# EAGLE design amyboard (EAGLE 9.6.2)
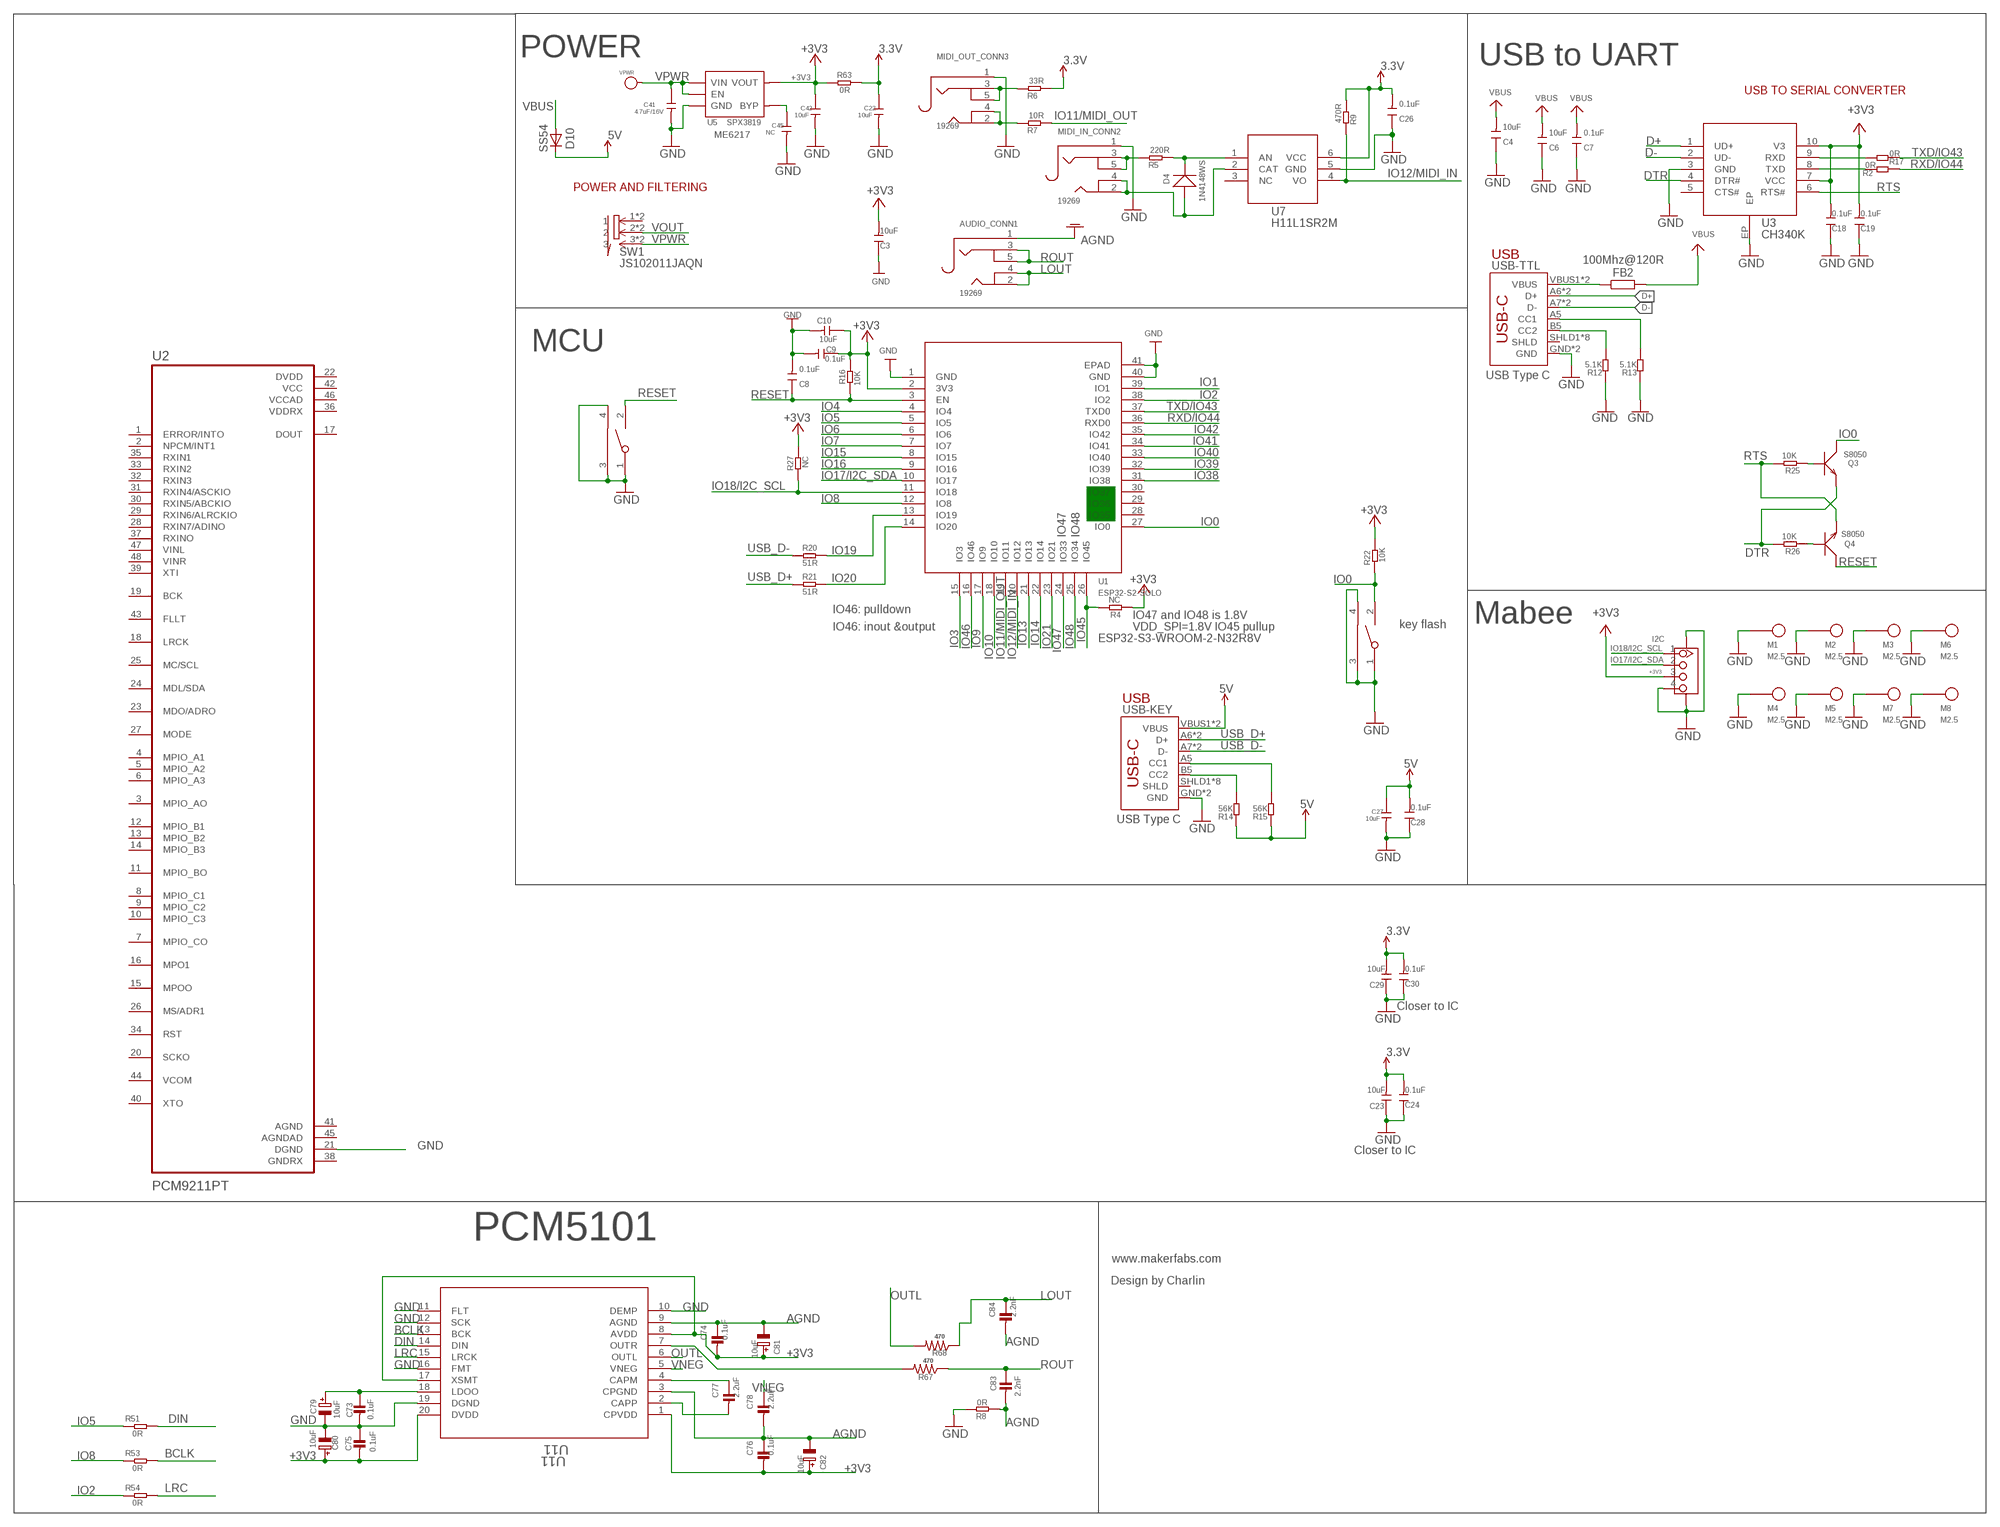
[diagram p0: schematic, sheet 1]

## Parts
AUDIO_CONN1  19269  AUDIO_3.5MMJACK  [4UCONN_19269]
BOOT  TS24CA  [2*4*3.5MM]
C3  10uF  DISCRETE_C-0603  [DISCRETE_C0603]
C4  10uF  DISCRETE_C-0603  [DISCRETE_C0603]
C6  10uF  DISCRETE_C-0603  [DISCRETE_C0603]
C7  0.1uF  DISCRETE_C-0603  [DISCRETE_C0603]
C8  0.1uF  DISCRETE_C-0603  [DISCRETE_C0603]
C9  0.1uF  DISCRETE_C-0603  [DISCRETE_C0603]
C10  10uF  DISCRETE_C-0603  [DISCRETE_C0603]
C18  0.1uF  DISCRETE_C-0603  [DISCRETE_C0603]
C19  0.1uF  DISCRETE_C-0603  [DISCRETE_C0603]
C22  10uF  C-0603  [0603]
C23  10uF  DISCRETE_C-0603  [DISCRETE_C0603]
C24  0.1uF  DISCRETE_C-0603  [DISCRETE_C0603]
C26  0.1uF  DISCRETE_C-0603  [DISCRETE_C0603]
C27  10uF  C-0603  [0603]
C28  0.1uF  DISCRETE_C-0603  [DISCRETE_C0603]
C29  10uF  DISCRETE_C-0603  [DISCRETE_C0603]
C30  0.1uF  DISCRETE_C-0603  [DISCRETE_C0603]
C41  4.7uF/16V  C-0603  [0603]
C42  10uF  C-0603  [0603]
C45  NC  C-0603  [0603]
C73  0.1uF  CAP_CERAMIC0805-NOOUTLINE  [0805-NO@1]
C74  0.1uF  CAP_CERAMIC0805-NOOUTLINE  [0805-NO@1]
C75  0.1uF  CAP_CERAMIC0805-NOOUTLINE  [0805-NO@1]
C76  0.1uF  CAP_CERAMIC0805-NOOUTLINE  [0805-NO@1]
C77  2.2uF  CAP_CERAMIC0805-NOOUTLINE  [0805-NO@1]
C78  2.2uF  CAP_CERAMIC0805-NOOUTLINE  [0805-NO@1]
C79  10uF  CAP_ELECTROLYTICPANASONIC_C  [PANASONIC_C]
C80  10uF  CAP_ELECTROLYTICPANASONIC_C  [PANASONIC_C]
C81  10uF  CAP_ELECTROLYTICPANASONIC_C  [PANASONIC_C]
C82  10uF  CAP_ELECTROLYTICPANASONIC_C  [PANASONIC_C]
C83  2.2nF  CAP_CERAMIC0805-NOOUTLINE  [0805-NO@1]
C84  2.2nF  CAP_CERAMIC0805-NOOUTLINE  [0805-NO@1]
D4  1N4148WS  D'0805'  [SOD323]
D10  SS54  DIODE-DO-214AC  [DO-214AC]
FB2  100Mhz@120R  R-EU_R0805  [R0805]
I2C  GROVE-CONNECTOR-SMD'90D'  [HW4-SMD-2.0-90D]
M1  M2.5  [M2.5]
M2  M2.5  [M2.5]
M3  M2.5  [M2.5]
M4  M2.5  [M2.5]
M5  M2.5  [M2.5]
M6  M2.5  [M2.5]
M7  M2.5  [M2.5]
M8  M2.5  [M2.5]
MIDI_IN_CONN2  19269  AUDIO_3.5MMJACK  [4UCONN_19269]
MIDI_OUT_CONN3  19269  AUDIO_3.5MMJACK  [4UCONN_19269]
Q3  S8050  TRANSISTOR-NPN-SOT23  [SOT23]
Q4  S8050  TRANSISTOR-NPN-SOT23  [SOT23]
R2  0R  R-0603  [R0603]
R4  NC  R-0603  [R0603]
R5  220R  R-0603  [R0603]
R6  33R  R-0603  [R0603]
R7  10R  R-0603  [R0603]
R8  0R  DISCRETE_R-0603  [DISCRETE_R0603]
R9  470R  R-0603  [R0603]
R12  5.1K  DISCRETE_R-0603  [DISCRETE_R0603]
R13  5.1K  DISCRETE_R-0603  [DISCRETE_R0603]
R14  56K  DISCRETE_R-0603  [DISCRETE_R0603]
R15  56K  DISCRETE_R-0603  [DISCRETE_R0603]
R16  10K  R-0603  [R0603]
R17  0R  R-0603  [R0603]
R20  51R  R-0603  [R0603]
R21  51R  R-0603  [R0603]
R22  10K  R-0603  [R0603]
R25  10K  R-0603  [R0603]
R26  10K  R-0603  [R0603]
R27  NC  R-0603  [R0603]
R51  0R  R-0603  [R0603]
R53  0R  R-0603  [R0603]
R54  0R  R-0603  [R0603]
R63  0R  R-0603  [R0603]
R67  470  R-US_R0805  [R0805]
R68  470  R-US_R0805  [R0805]
RST  TS24CA  [2*4*3.5MM]
SW1  JS102011JAQN  [SMD-6-2.5MM]
U1  ESP32­S2­SOLO  [ESP32-­S2-­SOLO]
U2  PCM9211PT  [QFP50P900X900X160-48N]
U3  CH340K  [ESOP-10-EP-150MIL]
U5  SPX3819  [SOT23-5]
U7  H11L1SR2M  [SOP-6-2.54MM]
U11  U11  PCM5101APW  [PW20_TEX]
USB-KEY  USB_C5  [USB-C-16P-5]
USB-TTL  USB_C5  [USB-C-16P-5]
VPWR  PAD-TEST-POINT-CIRCLE'4545'  [TP_4545]

## Nets
3.3V: C22.1 C23.2 C24.2 C26.2 C29.2 C30.2 R6.1 R9.1 R63.2 U7.6(VCC)
5V: C27.1 C28.2 D10.C R14.1 R15.1 USB-KEY.VBUS1(VBUS) USB-KEY.VBUS2(VBUS)
+3V3: C3.2 C9.1 C10.1 C18.2 C19.2 C42.1 C74.2 C75.2 C76.2 C80.+ C81.+ C82.+ I2C.3 R4.1 R16.2 R22.2 R27.2 R63.1 U1.2(3V3) U3.7(VCC) U3.10(V3) U5.5(VOUT) U11.1(CPVDD) U11.8(AVDD) U11.17(XSMT) U11.20(DVDD)
AGND: AUDIO_CONN1.1 C74.1 C76.1 C78.2 C81.- C82.- C83.2 C84.2 R8.1 U11.3(CPGND) U11.9(AGND)
BCLK: R53.2 U11.13(BCK)
D+: U3.1(UD+) USB-TTL.A6(D+) USB-TTL.B6(D+)
D-: U3.2(UD-) USB-TTL.A7(D-) USB-TTL.B7(D-)
DIN: R51.2 U11.14(DIN)
DTR: Q3.2(E) R26.2 U3.4(DTR#)
GND: BOOT.1 BOOT.3 BOOT.4 C3.1 C4.1 C6.1 C7.1 C8.2 C9.2 C10.2 C18.1 C19.1 C22.2 C23.1 C24.1 C26.1 C27.2 C28.1 C29.1 C30.1 C41.2 C42.2 C45.2 C73.2 C75.1 C79.- C80.- I2C.4 I2C.SS1 I2C.SS2 M1.1 M2.1 M3.1 M4.1 M5.1 M6.1 M7.1 M8.1 MIDI_IN_CONN2.1 MIDI_OUT_CONN3.1 R8.2 R12.1 R13.1 RST.1 RST.3 RST.4 U1.1(GND) U1.40(GND) U1.41(EPAD) U2.21(DGND) U3.3(GND) U3.EP U5.2(GND) U7.5(GND) U11.10(DEMP) U11.11(FLT) U11.12(SCK) U11.16(FMT) U11.19(DGND) USB-KEY.GND USB-KEY.GND2(GND) USB-TTL.GND USB-TTL.GND2(GND)
IO0: BOOT.2 Q3.3(C) R22.1 U1.27(IO0)
IO1: U1.39(IO1)
IO2: R54.1 U1.38(IO2)
IO3: U1.15(IO3)
IO4: U1.4(IO4)
IO5: R51.1 U1.5(IO5)
IO6: U1.6(IO6)
IO7: U1.7(IO7)
IO8: R53.1 U1.12(IO8)
IO9: U1.17(IO9)
IO10: U1.18(IO10)
IO11/MIDI_OUT: R7.1 U1.19(IO11)
IO12/MIDI_IN: R9.2 U1.20(IO12) U7.4(VO)
IO13: U1.21(IO13)
IO14: U1.22(IO14)
IO15: U1.8(IO15)
IO16: U1.9(IO16)
IO17/I2C_SDA: I2C.2 U1.10(IO17)
IO18/I2C_SCL: I2C.1 R27.1 U1.11(IO18)
IO19: R20.2 U1.13(IO19)
IO20: R21.2 U1.14(IO20)
IO21: U1.23(IO21)
IO38: U1.31(IO38)
IO39: U1.32(IO39)
IO40: U1.33(IO40)
IO41: U1.34(IO41)
IO42: U1.35(IO42)
IO45: R4.2 U1.26(IO45)
IO46: U1.16(IO46)
IO47: U1.24(IO33)
IO48: U1.25(IO34)
LOUT: AUDIO_CONN1.2 AUDIO_CONN1.4 C84.1 R68.1
LRC: R54.2 U11.15(LRCK)
N$2: Q4.1(B) R26.1
N$3: Q3.1(B) R25.1
N$6: R15.2 USB-KEY.A5(CC1)
N$10: R13.2 USB-TTL.A5(CC1)
N$11: R12.2 USB-TTL.B5(CC2)
N$14: R14.2 USB-KEY.B5(CC2)
N$21: FB2.1 USB-TTL.VBUS1(VBUS) USB-TTL.VBUS2(VBUS)
N$23: MIDI_IN_CONN2.3 MIDI_IN_CONN2.5 R5.2
N$26: D4.- R5.1 U7.1(AN)
N$27: MIDI_OUT_CONN3.3 MIDI_OUT_CONN3.5 R6.2
N$35: MIDI_OUT_CONN3.2 MIDI_OUT_CONN3.4 R7.2
N$36: D4.+ MIDI_IN_CONN2.2 MIDI_IN_CONN2.4 U7.2(CAT)
N$43: C73.1 C79.+ U11.18(LDOO)
N$44: R67.2 U11.7(OUTR)
N$45: C77.1 U11.4(CAPM)
N$46: R17.2 U3.9(RXD)
N$47: C77.2 U11.2(CAPP)
N$49: R2.2 U3.8(TXD)
N$76: C45.1 U5.4(BYP)
OUTL: R68.2 U11.6(OUTL)
RESET: C8.1 Q4.3(C) R16.1 RST.2 U1.3(EN)
ROUT: AUDIO_CONN1.3 AUDIO_CONN1.5 C83.1 R67.1
RTS: Q4.2(E) R25.2 U3.6(RTS#)
RXD/IO44: R2.1 U1.36(RXD0)
TXD/IO43: R17.1 U1.37(TXD0)
USB_D+: R21.1 USB-KEY.A6(D+) USB-KEY.B6(D+)
USB_D-: R20.1 USB-KEY.A7(D-) USB-KEY.B7(D-)
VBUS: C4.2 C6.2 C7.2 D10.A FB2.2
VNEG: C78.1 U11.5(VNEG)
VOUT: SW1.2 SW1.2@1
VPWR: C41.1 SW1.3 SW1.3@1 U5.1(VIN) U5.3(EN) VPWR.T
Unconnected: SW1.1 SW1.1@1 U1.28(IO35) U1.29(IO36) U1.30(IO37) U2.1(ERROR/INTO) U2.2(NPCM/INT1) U2.3(MPIO_AO) U2.4(MPIO_A1) U2.5(MPIO_A2) U2.6(MPIO_A3) U2.7(MPIO_CO) U2.8(MPIO_C1) U2.9(MPIO_C2) U2.10(MPIO_C3) U2.11(MPIO_BO) U2.12(MPIO_B1) U2.13(MPIO_B2) U2.14(MPIO_B3) U2.15(MPOO) U2.16(MPO1) U2.17(DOUT) U2.18(LRCK) U2.19(BCK) U2.20(SCKO) U2.23(MDO/ADRO) U2.24(MDL/SDA) U2.25(MC/SCL) U2.26(MS/ADR1) U2.27(MODE) U2.28(RXIN7/ADINO) U2.29(RXIN6/ALRCKIO) U2.30(RXIN5/ABCKIO) U2.31(RXIN4/ASCKIO) U2.32(RXIN3) U2.33(RXIN2) U2.34(RST) U2.35(RXIN1) U2.37(RXINO) U2.39(XTI) U2.40(XTO) U2.43(FLLT) U2.44(VCOM) U2.47(VINL) U2.48(VINR) U3.5(CTS#) U7.3(NC) USB-KEY.SHLD1(SHLD) USB-KEY.SHLD2(SHLD) USB-KEY.SHLD3(SHLD) USB-KEY.SHLD4(SHLD) USB-KEY.SHLD5(SHLD) USB-KEY.SHLD6(SHLD) USB-KEY.SHLD7(SHLD) USB-KEY.SHLD8(SHLD) USB-TTL.SHLD1(SHLD) USB-TTL.SHLD2(SHLD) USB-TTL.SHLD3(SHLD) USB-TTL.SHLD4(SHLD) USB-TTL.SHLD5(SHLD) USB-TTL.SHLD6(SHLD) USB-TTL.SHLD7(SHLD) USB-TTL.SHLD8(SHLD)

## Notes on the sheet
- POWER | USB to UART
- USB TO SERIAL CONVERTER
- ME6217
- POWER AND FILTERING
- USB
- MCU
- USB Type C
- IO47 | IO48
- IO46: pulldown
- IO47 and IO48 is 1.8V
- Mabee
- IO46: inout &output | VDD_SPI=1.8V IO45 pullup | key flash
- ESP32-S3-WROOM-2-N32R8V
- USB
- USB Type C
- Closer to IC
- Closer to IC
- PCM5101
- www.makerfabs.com
- Design by Charlin

## Power pins joined to a net without a drawn wire
AGND: U2.41(AGND)
AGNDAD: U2.45(AGNDAD)
DVDD: U2.22(DVDD)
GNDRX: U2.38(GNDRX)
VCC: U2.42(VCC)
VCCAD: U2.46(VCCAD)
VDDRX: U2.36(VDDRX)

## Library data of the parts
AUDIO_CONN1 MIDI_IN_CONN2 MIDI_OUT_CONN3 = microbuilder:AUDIO_3.5MMJACK: 3.5MM Audio Jack These are normally connected as follows, from left-to right on the schematic symbol above: Tip: Left Audio Inner Ring: Right Audio Shell: Common/GND
BOOT RST = sale:TS24CA
C3 C4 C6-C10 C18 C19 C23 C24 C26 C28-C30 = A9G:DISCRETE_C*: Ceramic Capacitors
C22 C27 C41 C42 C45 = Discrete:C*: Ceramic Capacitors
C73-C78 C83 C84 = microbuilder:CAP_CERAMIC: Ceramic Capacitors For new designs, use the packages preceded by an '_' character since they are more reliable: The following footprints should be used on most boards: _0402 - Standard footprint for regular board layouts _0603 - Standard footprint for regular board layouts _0805 - Standard footprint for regular board layouts _1206 - Standard footprint for regular board layouts For extremely tight-pitch boards where space is at a premium, the following 'micro-pitch' footprints can be used (smaller pads, no silkscreen outline, etc.): _0402MP - Micro-pitch footprint for very dense/compact boards _0603MP - Micro-pitch footprint for very dense/compact boards _0805MP - Micro-pitch footprint for very dense/compact boards _1206MP - Micro-pitch footprint for very dense/compact boards
C79-C82 = microbuilder:CAP_ELECTROLYTIC: Electrolytic Capacitors SMT PANASONIC_C - Size C Panasonic Electrolytic Aluminum Capacitor 47µF 16V 20% Electrolytic Capacitor [Digikey: PCE3890TR-ND] PANASONIC_D - Size D Panasonic Electrolytic Aluminum Capacitor 100µF 25V 20% Electrolytic Capacitor [Digikey: PCE3898TR-ND] PTH 3.5 mm grid, 8 mm diameter ... 3.5 mm grid, 10 mm diameter ...
D4 = Discrete:D*
D10 = diode:DIODE-: DIODE
FB2 = rcl:R-EU_: RESISTOR, European symbol
I2C = Connector-new:GROVE-CONNECTOR-SMD: 4P-SMD-2.0:320110030;4P-SMD-2.0-90D:320110032
M1-M8 = sale:M2.5
Q3 Q4 = Discrete:TRANSISTOR-NPN*: NPN audion
R2 R4-R7 R9 R16 R17 R20-R22 R25-R27 R51 R53 R54 R63 = Discrete:R*
R8 R12-R15 = A9G:DISCRETE_R*
R67 R68 = adafruit:R-US_: RESISTOR, American symbol
SW1 = sale:JS102011JAQN
U1 = self:ESP32­S2­SOLO
U2 = PCM9211PT:PCM9211PT: Check availability <https://pricing.snapeda.com/parts/PCM9211PT/Texas%20Instruments/view-part?ref=eda>; AVAILABILITY: In Stock; CHECK_PRICES: https://www.snapeda.com/parts/PCM9211PT/Texas+Instruments/view-part/?ref=eda; DESCRIPTION: 216kHz Digital Audio Interface Transceiver (DIX) with Stereo ADC and Routing; MF: Texas Instruments; MP: PCM9211PT; PACKAGE: LQFP-48 Texas Instruments; PRICE: None; SNAPEDA_LINK: https://www.snapeda.com/parts/PCM9211PT/Texas+Instruments/view-part/?ref=snap
U3 = sale:CH340K
U5 = IC:SPX3819
U7 = sale:H11L1SR2M
U11 = pcm5101apw:PCM5101APW; COPYRIGHT: Copyright (C) 2022 Ultra Librarian. All rights reserved.; DIGI-KEY_PART_NUMBER_1: PCM5101APW-ND; MANUFACTURER_PART_NUMBER: PCM5101APW; MFR_NAME: Texas Instruments
USB-KEY USB-TTL = USBC:USB_C: USB Type C 16Pin Connector Super Speed pins not available on the 16-pin purely SMD connector so this part is best for USB 2.0 implementations. D1 and D2 are tied together enabling D+/- no matter which way the cable is plugged into the connector. The two channel configuration pins (CC1/2) are exposed. These are normally connected to ground via 5.1k resistors but can be reconfigured for high current/high power applications.
VPWR = Discrete:PAD-TEST-POINT-CIRCLE; PARTNO: DNP

## Net classes
0 default: width 0.203 mm, drill 0.305 mm, clearance 0.152 mm
1 vbat: width 0.254 mm, drill 0.305 mm, clearance 0.152 mm

## Board
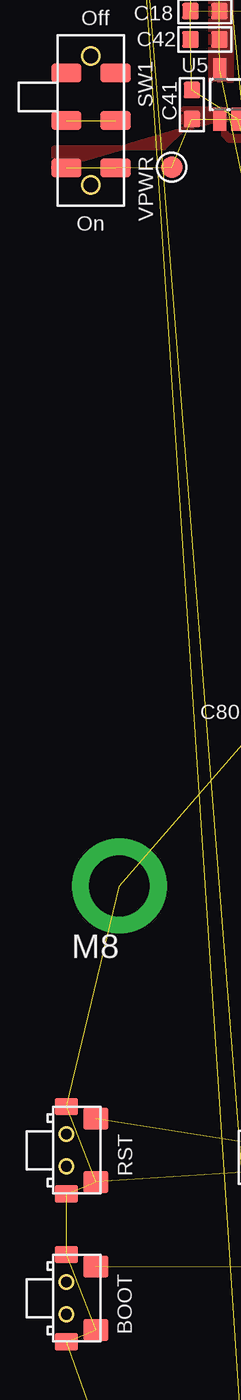
[diagram p1: board, top side]
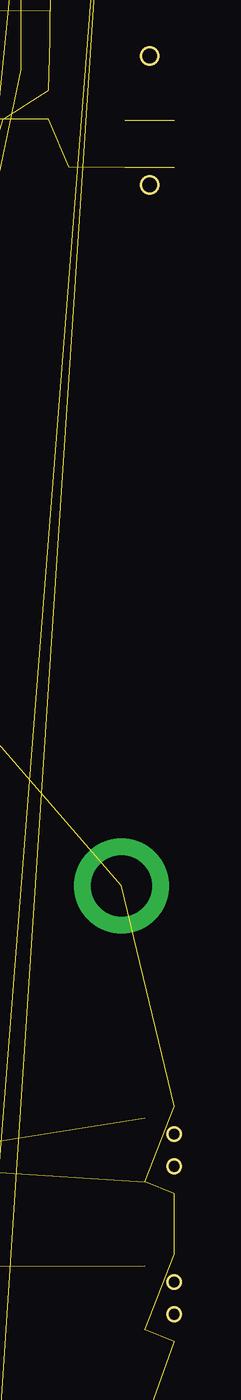
[diagram p2: board, bottom side, seen from below]

Size 2.09 x 67.12 mm. Coordinates in mm from the lower left corner, seen from the top.
Copper layers (1*16): Top 0.035mm / dielectric 1.5mm / Bottom 0.035mm
Design rules "default": minimum track width 6mil, minimum drill 10mil, track to track 6mil, track to pad 6mil, pad to pad 6mil, via to via 6mil, smd to smd 0mil, copper to edge 10mil, drill to drill 10mil, minimum pad ring 3mil, minimum via ring 3mil, stop-mask expansion 2mil, vias tented up to drill 100mil, thermal gap 0mil
tRestrict: area -0.9,-42.9 to 5.9,-13.6; area -4.3,57 to -3.5,63.5
bRestrict: area -0.9,-42.9 to 5.9,-13.6

### Footprints (pad centres in the part's own frame; a part is rotated, then mirrored left to right if it is on the bottom)
4UCONN_19269 = smd 2 x 2.5: 1 2.5,-3.5; 2 11.7,-3.5; 3 4.3,3.5 | smd 2.5 x 2: 4 15.8,0.75 | smd 1.2 x 2.5: 5 1.5,3.5 | hole 2: 3.5,0; 10.5,0
2*4*3.5MM = smd 1.15 x 1.3: 1 -1.675,0; 2 1.675,0 | smd 0.9 x 1.2: 3 2.3,1.55; 4 -2.3,1.55
DISCRETE_C0603 = smd 0.889 x 0.889: 1 -0.762,0; 2 0.762,0
0603 = smd 0.889 x 0.889: 1 -0.762,0; 2 0.762,0
0805-NO@1 = smd 1.24 x 1.5: 1 -0.95,0; 2 0.95,0
PANASONIC_C = smd 2.6 x 1.4: + 2.05,0; - -2.05,0
SOD323 = smd 1 x 0.8: + -1.2,0; - 1.2,0
DO-214AC = smd 1.8 x 2.4: A 2.025,0; C -2.025,0
R0805 = smd 1.3 x 1.5: 1 -0.95,0; 2 0.95,0
HW4-SMD-2.0-90D = smd 1.01 x 2.74: 1 -3,-0.1; 2 -1,-0.1; 3 1,-0.1; 4 3,-0.1 | smd 1.5 x 3: SS1 -5.4,7.4; SS2 5.4,7.4
M2.5 = drill 3.2 pad 5: 1 0,0
SOT23 = smd 1.016 x 1.143: 1 -0.95,-1.016; 2 0.95,-1.016; 3 0,1.016
R0603 = smd 0.889 x 0.889: 1 -0.762,0; 2 0.762,0
DISCRETE_R0603 = smd 0.889 x 0.889: 1 -0.762,0; 2 0.762,0
R0805' = smd 1.1 x 1.4: 1 -1,0; 2 1,0
SMD-6-2.5MM = smd 1 x 1.6: 1 -2.5,1.3; 1@1 -2.5,-1.3; 2 0,1.3; 2@1 0,-1.3; 3 2.5,1.3; 3@1 2.5,-1.3
ESP32-­S2-­SOLO = smd 1.5 x 0.9: 1 -8.75,5.26; 2 -8.75,3.99; 3 -8.75,2.72; 4 -8.75,1.45; 5 -8.75,0.18; 6 -8.75,-1.09; 7 -8.75,-2.36; 8 -8.75,-3.63; 9 -8.75,-4.9; 10 -8.75,-6.17; 11 -8.75,-7.44; 12 -8.75,-8.71; 13 -8.75,-9.98; 14 -8.75,-11.25; 27 8.75,-11.25; 28 8.75,-9.98; 29 8.75,-8.71; 30 8.75,-7.44; 31 8.75,-6.17; 32 8.75,-4.9; 33 8.75,-3.63; 34 8.75,-2.36; 35 8.75,-1.09; 36 8.75,0.18; 37 8.75,1.45; 38 8.75,2.72; 39 8.75,3.99; 40 8.75,5.26 | smd 0.9 x 1.5: 15 -6.985,-12.5; 16 -5.715,-12.5; 17 -4.445,-12.5; 18 -3.175,-12.5; 19 -1.905,-12.5; 20 -0.635,-12.5; 21 0.635,-12.5; 22 1.905,-12.5; 23 3.175,-12.5; 24 4.445,-12.5; 25 5.715,-12.5; 26 6.985,-12.5 | smd 3.7 x 3.7: 41 -1.5,-2.46
QFP50P900X900X160-48N = smd 1.56 x 0.28: 1 -4.18,2.75; 2 -4.18,2.25; 3 -4.18,1.75; 4 -4.18,1.25; 5 -4.18,0.75; 6 -4.18,0.25; 7 -4.18,-0.25; 8 -4.18,-0.75; 9 -4.18,-1.25; 10 -4.18,-1.75; 11 -4.18,-2.25; 12 -4.18,-2.75; 25 4.18,-2.75; 26 4.18,-2.25; 27 4.18,-1.75; 28 4.18,-1.25; 29 4.18,-0.75; 30 4.18,-0.25; 31 4.18,0.25; 32 4.18,0.75; 33 4.18,1.25; 34 4.18,1.75; 35 4.18,2.25; 36 4.18,2.75 | smd 0.28 x 1.56: 13 -2.75,-4.18; 14 -2.25,-4.18; 15 -1.75,-4.18; 16 -1.25,-4.18; 17 -0.75,-4.18; 18 -0.25,-4.18; 19 0.25,-4.18; 20 0.75,-4.18; 21 1.25,-4.18; 22 1.75,-4.18; 23 2.25,-4.18; 24 2.75,-4.18; 37 2.75,4.18; 38 2.25,4.18; 39 1.75,4.18; 40 1.25,4.18; 41 0.75,4.18; 42 0.25,4.18; 43 -0.25,4.18; 44 -0.75,4.18; 45 -1.25,4.18; 46 -1.75,4.18; 47 -2.25,4.18; 48 -2.75,4.18
ESOP-10-EP-150MIL = smd 1.5 x 0.6: 1 -2.7,2; 2 -2.7,1; 3 -2.7,0; 4 -2.7,-1; 5 -2.7,-2; 6 2.7,-2; 7 2.7,-1; 8 2.7,0; 9 2.7,1; 10 2.7,2 | smd 2.4 x 3.2: EP 0,0
SOT23-5 = smd 0.69 x 1.2: 1 -0.95,-1.3; 2 0,-1.3; 3 0.95,-1.3; 4 0.95,1.3; 5 -0.95,1.3
SOP-6-2.54MM = smd 1.6 x 1.8: 1 -4.5,2.54; 2 -4.5,0; 3 -4.5,-2.54; 4 4.5,-2.54; 5 4.5,0; 6 4.5,2.54
PW20_TEX = smd 1.473 x 0.356: 1 -2.921,2.925; 2 -2.921,2.275; 3 -2.921,1.625; 4 -2.921,0.975; 5 -2.921,0.325; 6 -2.921,-0.325; 7 -2.921,-0.975; 8 -2.921,-1.625; 9 -2.921,-2.275; 10 -2.921,-2.925; 11 2.921,-2.925; 12 2.921,-2.275; 13 2.921,-1.625; 14 2.921,-0.975; 15 2.921,-0.325; 16 2.921,0.325; 17 2.921,0.975; 18 2.921,1.625; 19 2.921,2.275; 20 2.921,2.925
USB-C-16P-5 = smd 0.3 x 1: A5 -1.25,-0.34; A6 -0.25,-0.34; A7 0.25,-0.34; A8 1.25,-0.34; B5 1.75,-0.34; B6 0.75,-0.34; B7 -0.75,-0.34; B8 -1.75,-0.34 | smd 0.6 x 1: GND -3.225,-0.34; GND2 3.225,-0.34; VBUS1 -2.45,-0.34; VBUS2 2.45,-0.34 | smd 1 x 2.1: SHLD1 -4.32,-0.915; SHLD2 4.32,-0.915 | smd 1 x 2.1 bottom: SHLD3 -4.32,-0.915; SHLD4 4.32,-0.915 | smd 1 x 1.6: SHLD5 -4.32,-5.095; SHLD8 4.32,-5.095 | smd 1 x 1.6 bottom: SHLD6 -4.32,-5.095; SHLD7 4.32,-5.095 | hole 0.65: -2.89,-1.445; 2.89,-1.445
TP_4545 = smd 1.143 x 1.143: T 0,0

### Placement (x,y rotation side)
AUDIO_CONN1  36.92,86 270 top  (outside the outline)
BOOT  1.9,1.2 90 top
C3  7.66,70.58 0 top  (outside the outline)
C4  22.49,75.91 90 top  (outside the outline)
C6  23.99,75.91 90 top  (outside the outline)
C7  16.4,76.02 90 top  (outside the outline)
C8  10.07,8.63 270 top  (outside the outline)
C9  17.57,-62.92 180 top  (outside the outline)
C10  7.15,-38.51 180 top  (outside the outline)
C18  7.66,69.03 0 top  (outside the outline)
C19  5.17,75.86 0 top  (outside the outline)
C22  52.45,-32.48 180 top  (outside the outline)
C23  51.44,-50.24 0 top  (outside the outline)
C24  52.44,-36.23 0 top  (outside the outline)
C26  48.1,13.58 0 top  (outside the outline)
C27  95.41,76.14 0 top  (outside the outline)
C28  86.81,73.95 90 top  (outside the outline)
C29  51.45,-48.7 0 top  (outside the outline)
C30  52.45,-34.37 0 top  (outside the outline)
C41  6.97,64.1 90 top  (outside the outline)
C42  7.66,67.53 180 top  (outside the outline)
C45  10.45,68.29 90 top  (outside the outline)
C73  18.68,39.08 180 top  (outside the outline)
C74  17.67,24.73 180 top  (outside the outline)
C75  13.7,36.39 0 top  (outside the outline)
C76  17.67,27.22 180 top  (outside the outline)
C77  26.18,33.5 90 top  (outside the outline)
C78  20.64,26.16 270 top  (outside the outline)
C79  17.57,43.2 0 top  (outside the outline)
C80  13.1,32.02 0 top  (outside the outline)
C81  16.8,14.57 180 top  (outside the outline)
C82  16.8,20.47 180 top  (outside the outline)
C83  22.26,20.47 180 top  (outside the outline)
C84  22.26,22.96 180 top  (outside the outline)
D4  47.51,28.47 0 top  (outside the outline)
D10  29.72,75.02 90 top  (outside the outline)
FB2  27.16,79.98 270 top  (outside the outline)
I2C  19.32,-69.21 180 top  (outside the outline)
M1  4.6,-73.5 0 top  (outside the outline)
M2  52.1,-73.5 0 top  (outside the outline)
M3  4.6,80.5 0 top  (outside the outline)
M4  99.1,-44 0 top  (outside the outline)
M5  99.1,-21 0 top  (outside the outline)
M6  76.1,80.5 0 top  (outside the outline)
M7  99.1,81 0 top  (outside the outline)
M8  3.14,22.93 0 top
MIDI_IN_CONN2  51.25,86 270 top  (outside the outline)
MIDI_OUT_CONN3  64.58,86 270 top  (outside the outline)
Q3  14.51,2.86 90 top  (outside the outline)
Q4  13.98,9.39 90 top  (outside the outline)
R2  5.15,74.34 0 top  (outside the outline)
R4  8.68,-40.49 0 top  (outside the outline)
R5  51.37,28.47 0 top  (outside the outline)
R6  49.62,15.26 0 top  (outside the outline)
R7  31.03,-29.42 0 top  (outside the outline)
R8  26.18,29.99 90 top  (outside the outline)
R9  45.15,15.26 180 top  (outside the outline)
R12  18.02,76.04 90 top  (outside the outline)
R13  20.99,75.94 90 top  (outside the outline)
R14  88.3,75.51 90 top  (outside the outline)
R15  92.93,75.53 90 top  (outside the outline)
R16  13.45,6.14 270 top  (outside the outline)
R17  5.15,72.76 0 top  (outside the outline)
R20  91.38,75.53 270 top  (outside the outline)
R21  89.83,75.51 270 top  (outside the outline)
R22  11.93,3.63 90 top  (outside the outline)
R25  17.87,6.24 90 top  (outside the outline)
R26  15.47,6.24 270 top  (outside the outline)
R27  49.01,-46.31 90 top  (outside the outline)
R51  23.74,40.35 180 top  (outside the outline)
R53  23.74,38.83 180 top  (outside the outline)
R54  23.71,41.95 180 top  (outside the outline)
R63  51.45,-45.55 0 top  (outside the outline)
R67  470  [R0805']  24.91,26.08 90 top  (outside the outline)
R68  470  [R0805']  22.67,26.16 90 top  (outside the outline)
RST  1.9,9 90 top
SW1  1.64,63.27 270 top
U1  11.9,-27.5 90 top  (outside the outline)
U2  -125.23,-322.51 0 top  (outside the outline)
U3  11.09,74.34 180 top  (outside the outline)
U5  9.39,64.64 0 top  (outside the outline)
U7  46.29,21.91 270 top  (outside the outline)
U11  20.99,33.47 90 top  (outside the outline)
USB-KEY  89.68,79.1 180 top  (outside the outline)
USB-TTL  19.79,78.99 180 top  (outside the outline)
VPWR  5.91,60.8 0 top  (outside the outline)

### Tracks (layer width: path | path; a pad name or v marks a point on that pad's centre or on a via)
3.3V  (9 unrouted)
5V  (6 unrouted)
+3V3  (25 unrouted)
  pour Top: 7.96,65.35 7.96,70.99 7.15,71.8 7.15,72.56 9.06,72.56 9.06,65.4 9.06,65.35
AGND  (11 unrouted)
  pour Top: 18,28.24 19.14,29.38 19.14,31.29 19.52,31.29 19.52,27.96 19.29,27.73 19.29,26.31 19.7,25.9 21.38,25.9 21.38,24.33 21.93,23.77
BCLK  (1 unrouted)
D+  (2 unrouted)
D-  (2 unrouted)
DIN  (1 unrouted)
DTR  (2 unrouted)
GND  (62 unrouted)
IO0  (3 unrouted)
IO2  (1 unrouted)
IO5  (1 unrouted)
IO8  (1 unrouted)
IO11/MIDI_OUT  (1 unrouted)
IO12/MIDI_IN  (2 unrouted)
IO17/I2C_SDA  (1 unrouted)
IO18/I2C_SCL  (2 unrouted)
IO19  (1 unrouted)
IO20  (1 unrouted)
IO45  (1 unrouted)
LOUT  (3 unrouted)
LRC  (1 unrouted)
N$2  (1 unrouted)
N$3  (1 unrouted)
N$6  (1 unrouted)
N$10  (1 unrouted)
N$11  (1 unrouted)
N$14  (1 unrouted)
N$21  (2 unrouted)
N$23  (2 unrouted)
N$26  (2 unrouted)
N$27  (2 unrouted)
N$35  (2 unrouted)
N$36  (3 unrouted)
N$43  (2 unrouted)
N$44  (1 unrouted)
N$45  (1 unrouted)
N$46  (1 unrouted)
N$47  (1 unrouted)
N$49  (1 unrouted)
N$76  (1 unrouted)
OUTL  (1 unrouted)
RESET  (4 unrouted)
ROUT  (3 unrouted)
RTS  (2 unrouted)
RXD/IO44  (1 unrouted)
TXD/IO43  (1 unrouted)
USB_D+  (2 unrouted)
USB_D-  (2 unrouted)
VBUS  (4 unrouted)
VNEG  (1 unrouted)
VOUT  (1 unrouted)
VPWR  (5 unrouted)
  pour Top: 10.12,63.85 10.12,62.4 9.92,62.2 8.96,62.2 8.73,62.43 8.65,62.5 8.65,63.85 6.49,63.85 6.49,62.81 5.48,61.79 -0.34,61.79 -0.34,60.85 -0.34,60.8 -0.34,60.78

### Text on the board
tPlace: CHRG | C36 | Audio Out | MIDI In | MIDI Out | Off | C41 | On | GND | +3V3 | IO17/SDA | IO18/SCL
tValues: Close
Measures: Units: Inches